# Altium schematic sheet POWER.SchDoc: Power Supply
size 420 x 297 mm; SheetNumber: 2; SheetTotal: 10
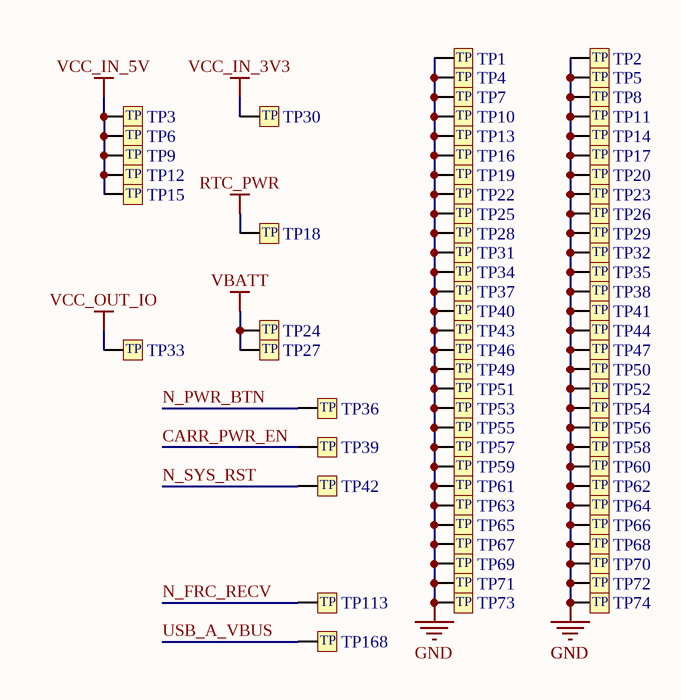
[diagram p0: POWER.SchDoc]

## Parts
TP1  TP_0P8MM  [TP_0P8MM]  (value not drawn)  (no BOM)
TP2  TP_0P8MM  [TP_0P8MM]  (value not drawn)  (no BOM)
TP3  TP_0P8MM  [TP_0P8MM]  (value not drawn)  (no BOM)
TP4  TP_0P8MM  [TP_0P8MM]  (value not drawn)  (no BOM)
TP5  TP_0P8MM  [TP_0P8MM]  (value not drawn)  (no BOM)
TP6  TP_0P8MM  [TP_0P8MM]  (value not drawn)  (no BOM)
TP7  TP_0P8MM  [TP_0P8MM]  (value not drawn)  (no BOM)
TP8  TP_0P8MM  [TP_0P8MM]  (value not drawn)  (no BOM)
TP9  TP_0P8MM  [TP_0P8MM]  (value not drawn)  (no BOM)
TP10  TP_0P8MM  [TP_0P8MM]  (value not drawn)  (no BOM)
TP11  TP_0P8MM  [TP_0P8MM]  (value not drawn)  (no BOM)
TP12  TP_0P8MM  [TP_0P8MM]  (value not drawn)  (no BOM)
TP13  TP_0P8MM  [TP_0P8MM]  (value not drawn)  (no BOM)
TP14  TP_0P8MM  [TP_0P8MM]  (value not drawn)  (no BOM)
TP15  TP_0P8MM  [TP_0P8MM]  (value not drawn)  (no BOM)
TP16  TP_0P8MM  [TP_0P8MM]  (value not drawn)  (no BOM)
TP17  TP_0P8MM  [TP_0P8MM]  (value not drawn)  (no BOM)
TP18  TP_0P8MM  [TP_0P8MM]  (value not drawn)  (no BOM)
TP19  TP_0P8MM  [TP_0P8MM]  (value not drawn)  (no BOM)
TP20  TP_0P8MM  [TP_0P8MM]  (value not drawn)  (no BOM)
TP22  TP_0P8MM  [TP_0P8MM]  (value not drawn)  (no BOM)
TP23  TP_0P8MM  [TP_0P8MM]  (value not drawn)  (no BOM)
TP24  TP_0P8MM  [TP_0P8MM]  (value not drawn)  (no BOM)
TP25  TP_0P8MM  [TP_0P8MM]  (value not drawn)  (no BOM)
TP26  TP_0P8MM  [TP_0P8MM]  (value not drawn)  (no BOM)
TP27  TP_0P8MM  [TP_0P8MM]  (value not drawn)  (no BOM)
TP28  TP_0P8MM  [TP_0P8MM]  (value not drawn)  (no BOM)
TP29  TP_0P8MM  [TP_0P8MM]  (value not drawn)  (no BOM)
TP30  TP_0P8MM  [TP_0P8MM]  (value not drawn)  (no BOM)
TP31  TP_0P8MM  [TP_0P8MM]  (value not drawn)  (no BOM)
TP32  TP_0P8MM  [TP_0P8MM]  (value not drawn)  (no BOM)
TP33  TP_0P8MM  [TP_0P8MM]  (value not drawn)  (no BOM)
TP34  TP_0P8MM  [TP_0P8MM]  (value not drawn)  (no BOM)
TP35  TP_0P8MM  [TP_0P8MM]  (value not drawn)  (no BOM)
TP36  TP_0P8MM  [TP_0P8MM]  (value not drawn)  (no BOM)
TP37  TP_0P8MM  [TP_0P8MM]  (value not drawn)  (no BOM)
TP38  TP_0P8MM  [TP_0P8MM]  (value not drawn)  (no BOM)
TP39  TP_0P8MM  [TP_0P8MM]  (value not drawn)  (no BOM)
TP40  TP_0P8MM  [TP_0P8MM]  (value not drawn)  (no BOM)
TP41  TP_0P8MM  [TP_0P8MM]  (value not drawn)  (no BOM)
TP42  TP_0P8MM  [TP_0P8MM]  (value not drawn)  (no BOM)
TP43  TP_0P8MM  [TP_0P8MM]  (value not drawn)  (no BOM)
TP44  TP_0P8MM  [TP_0P8MM]  (value not drawn)  (no BOM)
TP46  TP_0P8MM  [TP_0P8MM]  (value not drawn)  (no BOM)
TP47  TP_0P8MM  [TP_0P8MM]  (value not drawn)  (no BOM)
TP49  TP_0P8MM  [TP_0P8MM]  (value not drawn)  (no BOM)
TP50  TP_0P8MM  [TP_0P8MM]  (value not drawn)  (no BOM)
TP51  TP_0P8MM  [TP_0P8MM]  (value not drawn)  (no BOM)
TP52  TP_0P8MM  [TP_0P8MM]  (value not drawn)  (no BOM)
TP53  TP_0P8MM  [TP_0P8MM]  (value not drawn)  (no BOM)
TP54  TP_0P8MM  [TP_0P8MM]  (value not drawn)  (no BOM)
TP55  TP_0P8MM  [TP_0P8MM]  (value not drawn)  (no BOM)
TP56  TP_0P8MM  [TP_0P8MM]  (value not drawn)  (no BOM)
TP57  TP_0P8MM  [TP_0P8MM]  (value not drawn)  (no BOM)
TP58  TP_0P8MM  [TP_0P8MM]  (value not drawn)  (no BOM)
TP59  TP_0P8MM  [TP_0P8MM]  (value not drawn)  (no BOM)
TP60  TP_0P8MM  [TP_0P8MM]  (value not drawn)  (no BOM)
TP61  TP_0P8MM  [TP_0P8MM]  (value not drawn)  (no BOM)
TP62  TP_0P8MM  [TP_0P8MM]  (value not drawn)  (no BOM)
TP63  TP_0P8MM  [TP_0P8MM]  (value not drawn)  (no BOM)
TP64  TP_0P8MM  [TP_0P8MM]  (value not drawn)  (no BOM)
TP65  TP_0P8MM  [TP_0P8MM]  (value not drawn)  (no BOM)
TP66  TP_0P8MM  [TP_0P8MM]  (value not drawn)  (no BOM)
TP67  TP_0P8MM  [TP_0P8MM]  (value not drawn)  (no BOM)
TP68  TP_0P8MM  [TP_0P8MM]  (value not drawn)  (no BOM)
TP69  TP_0P8MM  [TP_0P8MM]  (value not drawn)  (no BOM)
TP70  TP_0P8MM  [TP_0P8MM]  (value not drawn)  (no BOM)
TP71  TP_0P8MM  [TP_0P8MM]  (value not drawn)  (no BOM)
TP72  TP_0P8MM  [TP_0P8MM]  (value not drawn)  (no BOM)
TP73  TP_0P8MM  [TP_0P8MM]  (value not drawn)  (no BOM)
TP74  TP_0P8MM  [TP_0P8MM]  (value not drawn)  (no BOM)
TP113  TP_0P8MM  [TP_0P8MM]  (value not drawn)  (no BOM)
TP168  TP_0P8MM  [TP_0P8MM]  (value not drawn)  (no BOM)

## Nets
GND: TP1.1 TP2.1 TP4.1 TP5.1 TP7.1 TP8.1 TP10.1 TP11.1 TP13.1 TP14.1 TP16.1 TP17.1 TP19.1 TP20.1 TP22.1 TP23.1 TP25.1 TP26.1 TP28.1 TP29.1 TP31.1 TP32.1 TP34.1 TP35.1 TP37.1 TP38.1 TP40.1 TP41.1 TP43.1 TP44.1 TP46.1 TP47.1 TP49.1 TP50.1 TP51.1 TP52.1 TP53.1 TP54.1 TP55.1 TP56.1 TP57.1 TP58.1 TP59.1 TP60.1 TP61.1 TP62.1 TP63.1 TP64.1 TP65.1 TP66.1 TP67.1 TP68.1 TP69.1 TP70.1 TP71.1 TP72.1 TP73.1 TP74.1
RTC_PWR: TP18.1
VBATT: TP24.1 TP27.1
VCC_IN_3V3: TP30.1
VCC_IN_5V: TP3.1 TP6.1 TP9.1 TP12.1 TP15.1
VCC_OUT_IO: TP33.1
CARR_PWR_EN: TP39.1
N_FRC_RECV: TP113.1
N_PWR_BTN: TP36.1
N_SYS_RST: TP42.1
USB_A_VBUS: TP168.1

## Notes on the sheet
- PROJECT
- SIZE
- FILE NAME
- A3
- TITLE
- SHEET
- OF
- REV
- (in symbol TP_0P8MM) TP

## Library data of the parts
TP1-TP20 TP22-TP44 TP46 TP47 TP49-TP74 TP113 TP168 = TP_0P8MM: OSM Footprint 0P8 LGA Ball